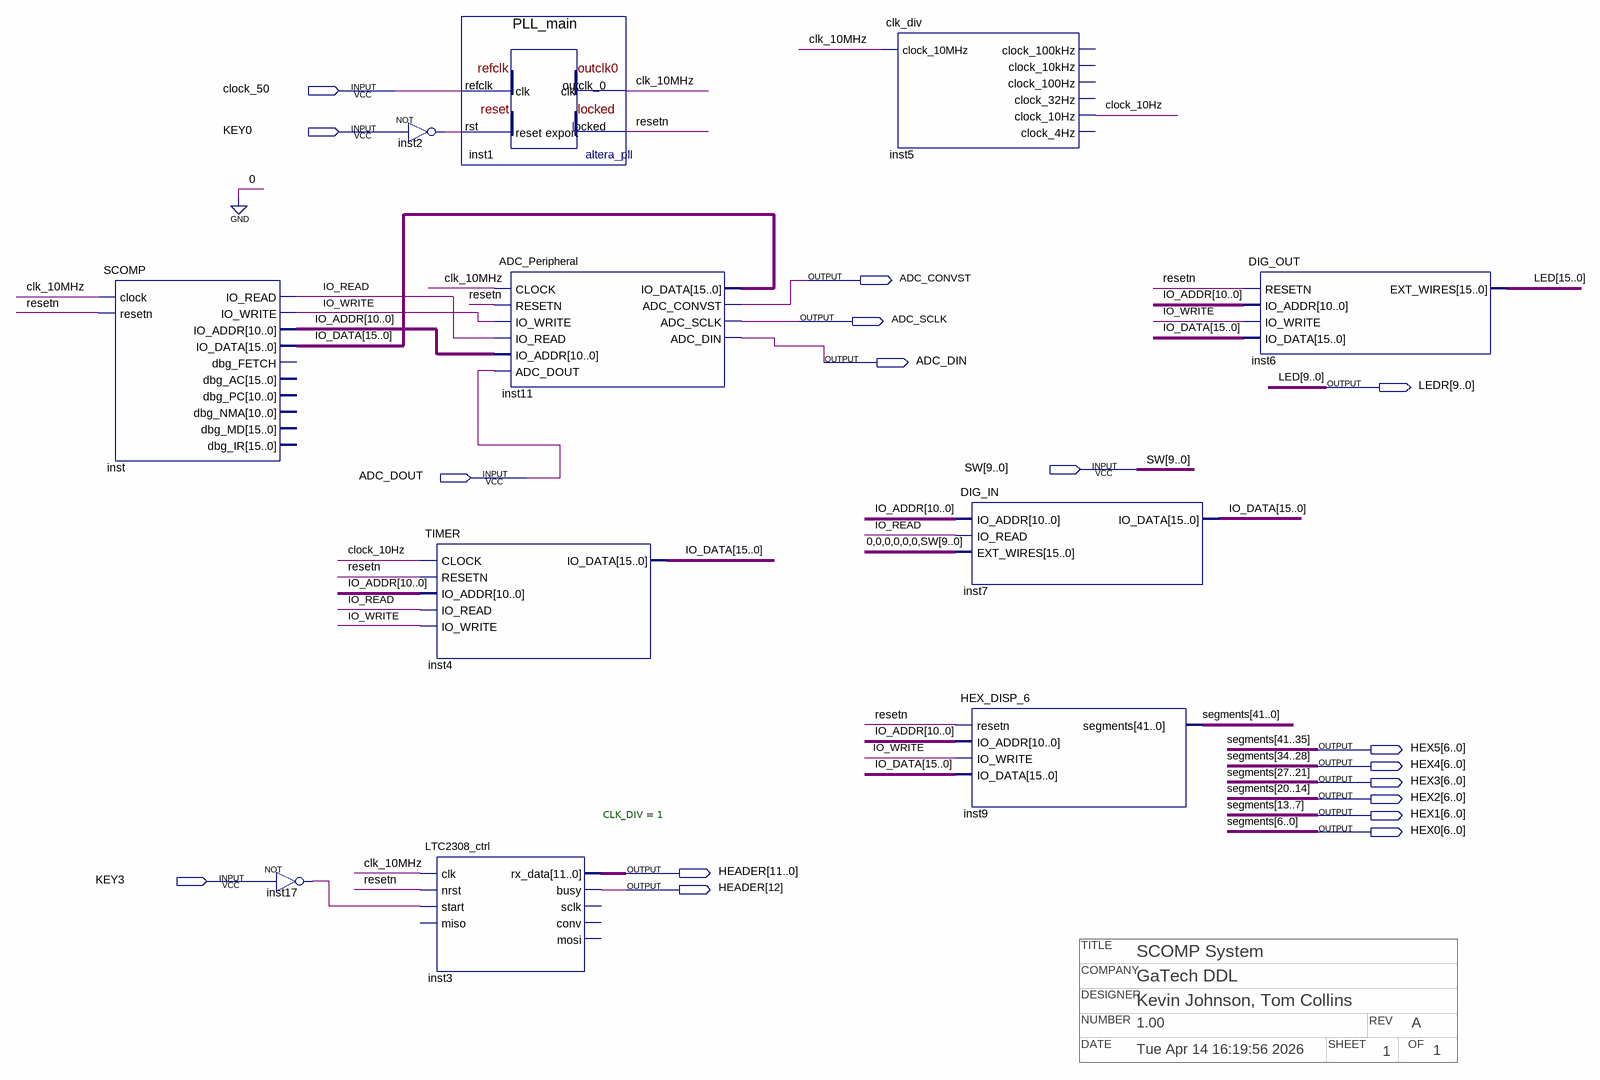
[diagram p0: schematic sheet]
// Quartus schematic SCOMP_System.bdf as structural Verilog: 11 symbols, 17 pins
// Title block: TITLE: SCOMP System; COMPANY: GaTech DDL; DESIGNER: Kevin Johnson, Tom Collins; NUMBER: 1.00; REV: A; DATE: Tue Apr 14 16:19:56 2026; SHEET: 1; OF: 1
module SCOMP_System (
  input  clock_50,
  input  KEY0,
  input  [9:0] SW,
  input  ADC_DOUT,
  input  KEY3,
  output ADC_CONVST,
  output ADC_SCLK,
  output ADC_DIN,
  output [9:0] LEDR,
  output [6:0] HEX5,
  output [6:0] HEX4,
  output [6:0] HEX3,
  output [6:0] HEX2,
  output [6:0] HEX1,
  output [6:0] HEX0,
  output [12:0] HEADER
);

  wire clk_10MHz, clock_10Hz, inst2_out, inst17_out, IO_READ, IO_WRITE, resetn;
  wire [10:0] IO_ADDR;
  wire [15:0] IO_DATA;
  wire [15:10] LED;

  SCOMP inst (
    .clock(clk_10MHz), .resetn(resetn), .IO_READ(IO_READ), .IO_WRITE(IO_WRITE), .IO_ADDR(IO_ADDR),
    .IO_DATA(IO_DATA));  // open: dbg_FETCH, dbg_AC, dbg_PC, dbg_NMA, dbg_MD, dbg_IR
  not inst17 (inst17_out, KEY3);
  not inst2 (inst2_out, KEY0);
  TIMER inst4 (
    .CLOCK(clock_10Hz), .RESETN(resetn), .IO_ADDR(IO_ADDR), .IO_READ(IO_READ), .IO_WRITE(IO_WRITE),
    .IO_DATA(IO_DATA));
  LTC2308_ctrl #(.CLK_DIV(1)) inst3 (
    .clk(clk_10MHz), .nrst(resetn), .start(inst17_out), .rx_data(HEADER[11:0]), .busy(HEADER[12]));  // open: miso, sclk, conv, mosi
  PLL_main inst1 (.refclk(clock_50), .rst(inst2_out), .outclk_0(clk_10MHz), .locked(resetn));
  ADC_Peripheral inst11 (
    .CLOCK(clk_10MHz), .RESETN(resetn), .IO_WRITE(IO_WRITE), .IO_READ(IO_READ), .IO_ADDR(IO_ADDR),
    .ADC_DOUT(ADC_DOUT), .ADC_CONVST(ADC_CONVST), .ADC_SCLK(ADC_SCLK), .ADC_DIN(ADC_DIN), .IO_DATA(IO_DATA));
  clk_div inst5 (
    .clock_10MHz(clk_10MHz), .clock_10Hz(clock_10Hz));  // open: clock_100kHz, clock_10kHz, clock_100Hz, clock_32Hz, clock_4Hz
  DIG_IN inst7 (.IO_ADDR(IO_ADDR), .IO_READ(IO_READ), .EXT_WIRES({{6{1'b0}}, SW}), .IO_DATA(IO_DATA));
  HEX_DISP_6 inst9 (
    .resetn(resetn), .IO_ADDR(IO_ADDR), .IO_WRITE(IO_WRITE), .IO_DATA(IO_DATA),
    .segments({HEX5, HEX4, HEX3, HEX2, HEX1, HEX0}));
  DIG_OUT inst6 (.RESETN(resetn), .IO_ADDR(IO_ADDR), .IO_WRITE(IO_WRITE), .IO_DATA(IO_DATA), .EXT_WIRES({LED, LEDR}));

  // Other names for the same wires on the sheet: LED[9:0] = LEDR;
  //   segments[41:0] = {HEX5, HEX4, HEX3, HEX2, HEX1, HEX0}
endmodule
